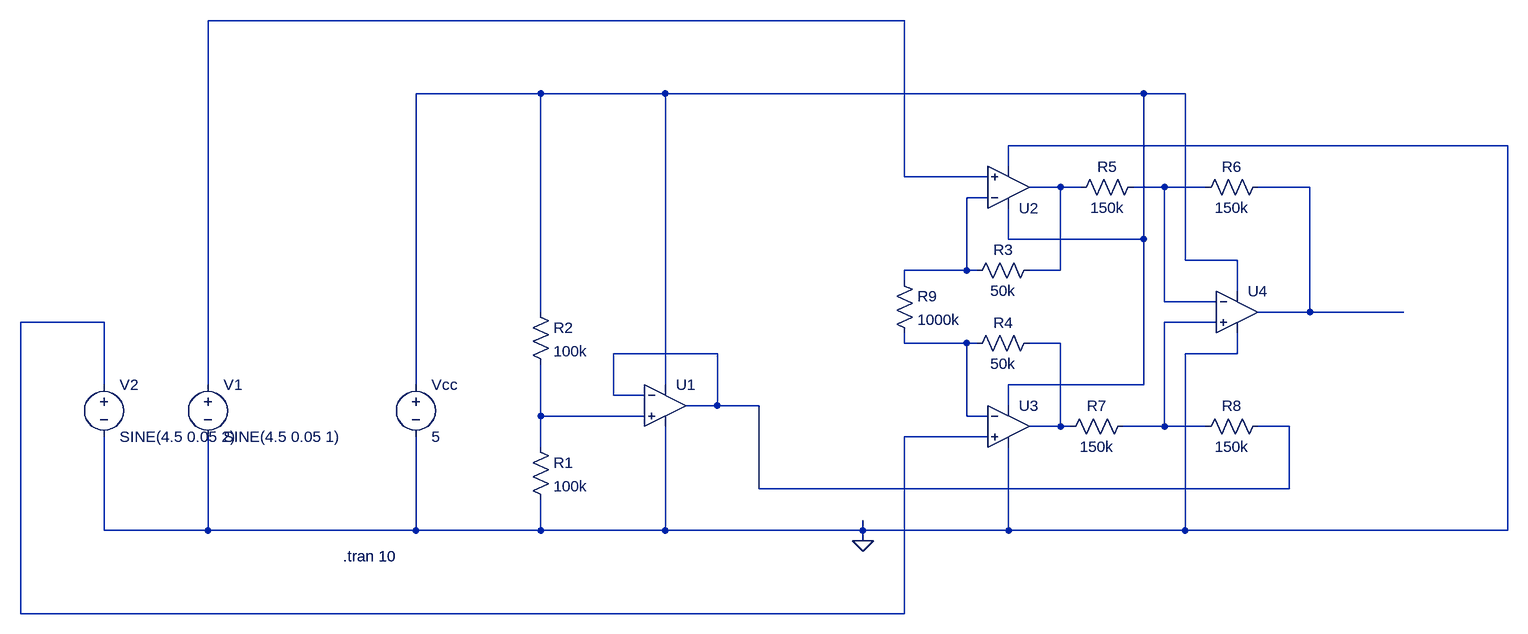
[diagram p0: schematic voltage adder.asc]
voltage adder.asc, the LTspice schematic file:
Version 4.1
SHEET 1 1236 680
WIRE 304 -608 -768 -608
WIRE -256 -496 -448 -496
WIRE -64 -496 -256 -496
WIRE 672 -496 -64 -496
WIRE 736 -496 672 -496
WIRE 1232 -416 464 -416
WIRE 464 -384 464 -416
WIRE 304 -368 304 -608
WIRE 432 -368 304 -368
WIRE 544 -352 496 -352
WIRE 576 -352 544 -352
WIRE 704 -352 656 -352
WIRE 768 -352 704 -352
WIRE 928 -352 848 -352
WIRE 432 -336 400 -336
WIRE 464 -272 464 -320
WIRE 672 -272 672 -496
WIRE 672 -272 464 -272
WIRE 736 -240 736 -496
WIRE 816 -240 736 -240
WIRE 400 -224 400 -336
WIRE 400 -224 304 -224
WIRE 416 -224 400 -224
WIRE 544 -224 544 -352
WIRE 544 -224 496 -224
WIRE 304 -208 304 -224
WIRE 816 -192 816 -240
WIRE 704 -176 704 -352
WIRE 784 -176 704 -176
WIRE -256 -160 -256 -496
WIRE 928 -160 928 -352
WIRE 928 -160 848 -160
WIRE 1072 -160 928 -160
WIRE -928 -144 -1056 -144
WIRE 784 -144 704 -144
WIRE 304 -112 304 -128
WIRE 400 -112 304 -112
WIRE 416 -112 400 -112
WIRE 544 -112 496 -112
WIRE 16 -96 -144 -96
WIRE 816 -96 816 -128
WIRE 816 -96 736 -96
WIRE -928 -48 -928 -144
WIRE -768 -48 -768 -608
WIRE -448 -48 -448 -496
WIRE -64 -48 -64 -496
WIRE 672 -48 672 -272
WIRE 672 -48 464 -48
WIRE -144 -32 -144 -96
WIRE -96 -32 -144 -32
WIRE 16 -16 16 -96
WIRE 16 -16 -32 -16
WIRE 80 -16 16 -16
WIRE 464 -16 464 -48
WIRE -256 0 -256 -80
WIRE -96 0 -256 0
WIRE 400 0 400 -112
WIRE 432 0 400 0
WIRE 544 16 544 -112
WIRE 544 16 496 16
WIRE 560 16 544 16
WIRE 704 16 704 -144
WIRE 704 16 640 16
WIRE 768 16 704 16
WIRE 896 16 848 16
WIRE 432 32 304 32
WIRE -256 48 -256 0
WIRE 80 112 80 -16
WIRE 896 112 896 16
WIRE 896 112 80 112
WIRE -928 176 -928 32
WIRE -768 176 -768 32
WIRE -768 176 -928 176
WIRE -448 176 -448 32
WIRE -448 176 -768 176
WIRE -256 176 -256 128
WIRE -256 176 -448 176
WIRE -64 176 -64 16
WIRE -64 176 -256 176
WIRE 240 176 240 160
WIRE 240 176 -64 176
WIRE 464 176 464 48
WIRE 464 176 240 176
WIRE 736 176 736 -96
WIRE 736 176 464 176
WIRE 1232 176 1232 -416
WIRE 1232 176 736 176
WIRE 240 192 240 176
WIRE -1056 304 -1056 -144
WIRE 304 304 304 32
WIRE 304 304 -1056 304
FLAG 240 192 0
SYMBOL voltage -448 -64 R0
WINDOW 123 0 0 Left 0
WINDOW 39 0 0 Left 0
SYMATTR InstName Vcc
SYMATTR Value 5
SYMBOL res -272 32 R0
SYMATTR InstName R1
SYMATTR Value 100k
SYMBOL res -272 -176 R0
SYMATTR InstName R2
SYMATTR Value 100k
SYMBOL Opamps\\UniversalOpamp2 -64 -16 R0
SYMATTR InstName U1
SYMBOL Opamps\\UniversalOpamp2 464 -352 M180
SYMATTR InstName U2
SYMBOL Opamps\\UniversalOpamp2 464 16 R0
SYMATTR InstName U3
SYMBOL Opamps\\UniversalOpamp2 816 -160 R0
SYMATTR InstName U4
SYMBOL res 512 -240 R90
WINDOW 0 0 56 VBottom 2
WINDOW 3 32 56 VTop 2
SYMATTR InstName R3
SYMATTR Value 50k
SYMBOL res 512 -128 R90
WINDOW 0 0 56 VBottom 2
WINDOW 3 32 56 VTop 2
SYMATTR InstName R4
SYMATTR Value 50k
SYMBOL res 672 -368 R90
WINDOW 0 0 56 VBottom 2
WINDOW 3 32 56 VTop 2
SYMATTR InstName R5
SYMATTR Value 150k
SYMBOL res 864 -368 R90
WINDOW 0 0 56 VBottom 2
WINDOW 3 32 56 VTop 2
SYMATTR InstName R6
SYMATTR Value 150k
SYMBOL res 656 0 R90
WINDOW 0 0 56 VBottom 2
WINDOW 3 32 56 VTop 2
SYMATTR InstName R7
SYMATTR Value 150k
SYMBOL res 864 0 R90
WINDOW 0 0 56 VBottom 2
WINDOW 3 32 56 VTop 2
SYMATTR InstName R8
SYMATTR Value 150k
SYMBOL res 288 -224 R0
SYMATTR InstName R9
SYMATTR Value 1000k
SYMBOL voltage -768 -64 R0
WINDOW 123 0 0 Left 0
WINDOW 39 0 0 Left 0
SYMATTR InstName V1
SYMATTR Value SINE(4.5 0.05 1)
SYMBOL voltage -928 -64 R0
WINDOW 123 0 0 Left 0
WINDOW 39 0 0 Left 0
SYMATTR InstName V2
SYMATTR Value SINE(4.5 0.05 2)
TEXT -560 216 Left 2 !.tran 10

The netlist it stands for:
* voltage adder.asc
Vcc N002 0 5
R1 N012 0 100k
R2 N002 N012 100k
X§U1 N012 N011 N002 0 N011 level.2 Avol=1Meg GBW=10Meg Slew=10Meg ilimit=25m rail=0 Vos=0 phimargin=45 en=0 enk=0 in=0 ink=0 Rin=500Meg  ; pins IN+ IN- V+ V- OUT
X§U2 N001 N006 N002 0 N003 level.2 Avol=1Meg GBW=10Meg Slew=10Meg ilimit=25m rail=0 Vos=0 phimargin=45 en=0 enk=0 in=0 ink=0 Rin=500Meg  ; pins IN+ IN- V+ V- OUT
X§U3 N007 N009 N002 0 N010 level.2 Avol=1Meg GBW=10Meg Slew=10Meg ilimit=25m rail=0 Vos=0 phimargin=45 en=0 enk=0 in=0 ink=0 Rin=500Meg  ; pins IN+ IN- V+ V- OUT
X§U4 N008 N004 N002 0 N005 level.2 Avol=1Meg GBW=10Meg Slew=10Meg ilimit=25m rail=0 Vos=0 phimargin=45 en=0 enk=0 in=0 ink=0 Rin=500Meg  ; pins IN+ IN- V+ V- OUT
R3 N003 N006 50k
R4 N010 N009 50k
R5 N004 N003 150k
R6 N005 N004 150k
R7 N008 N010 150k
R8 N011 N008 150k
R9 N006 N009 1000k
V1 N001 0 SINE(4.5 0.05 1)
V2 N007 0 SINE(4.5 0.05 2)
.tran 10
.lib UniversalOpamps2.sub
.backanno
.end